# EAGLE design Mimi_layout (EAGLE 7.6.0)
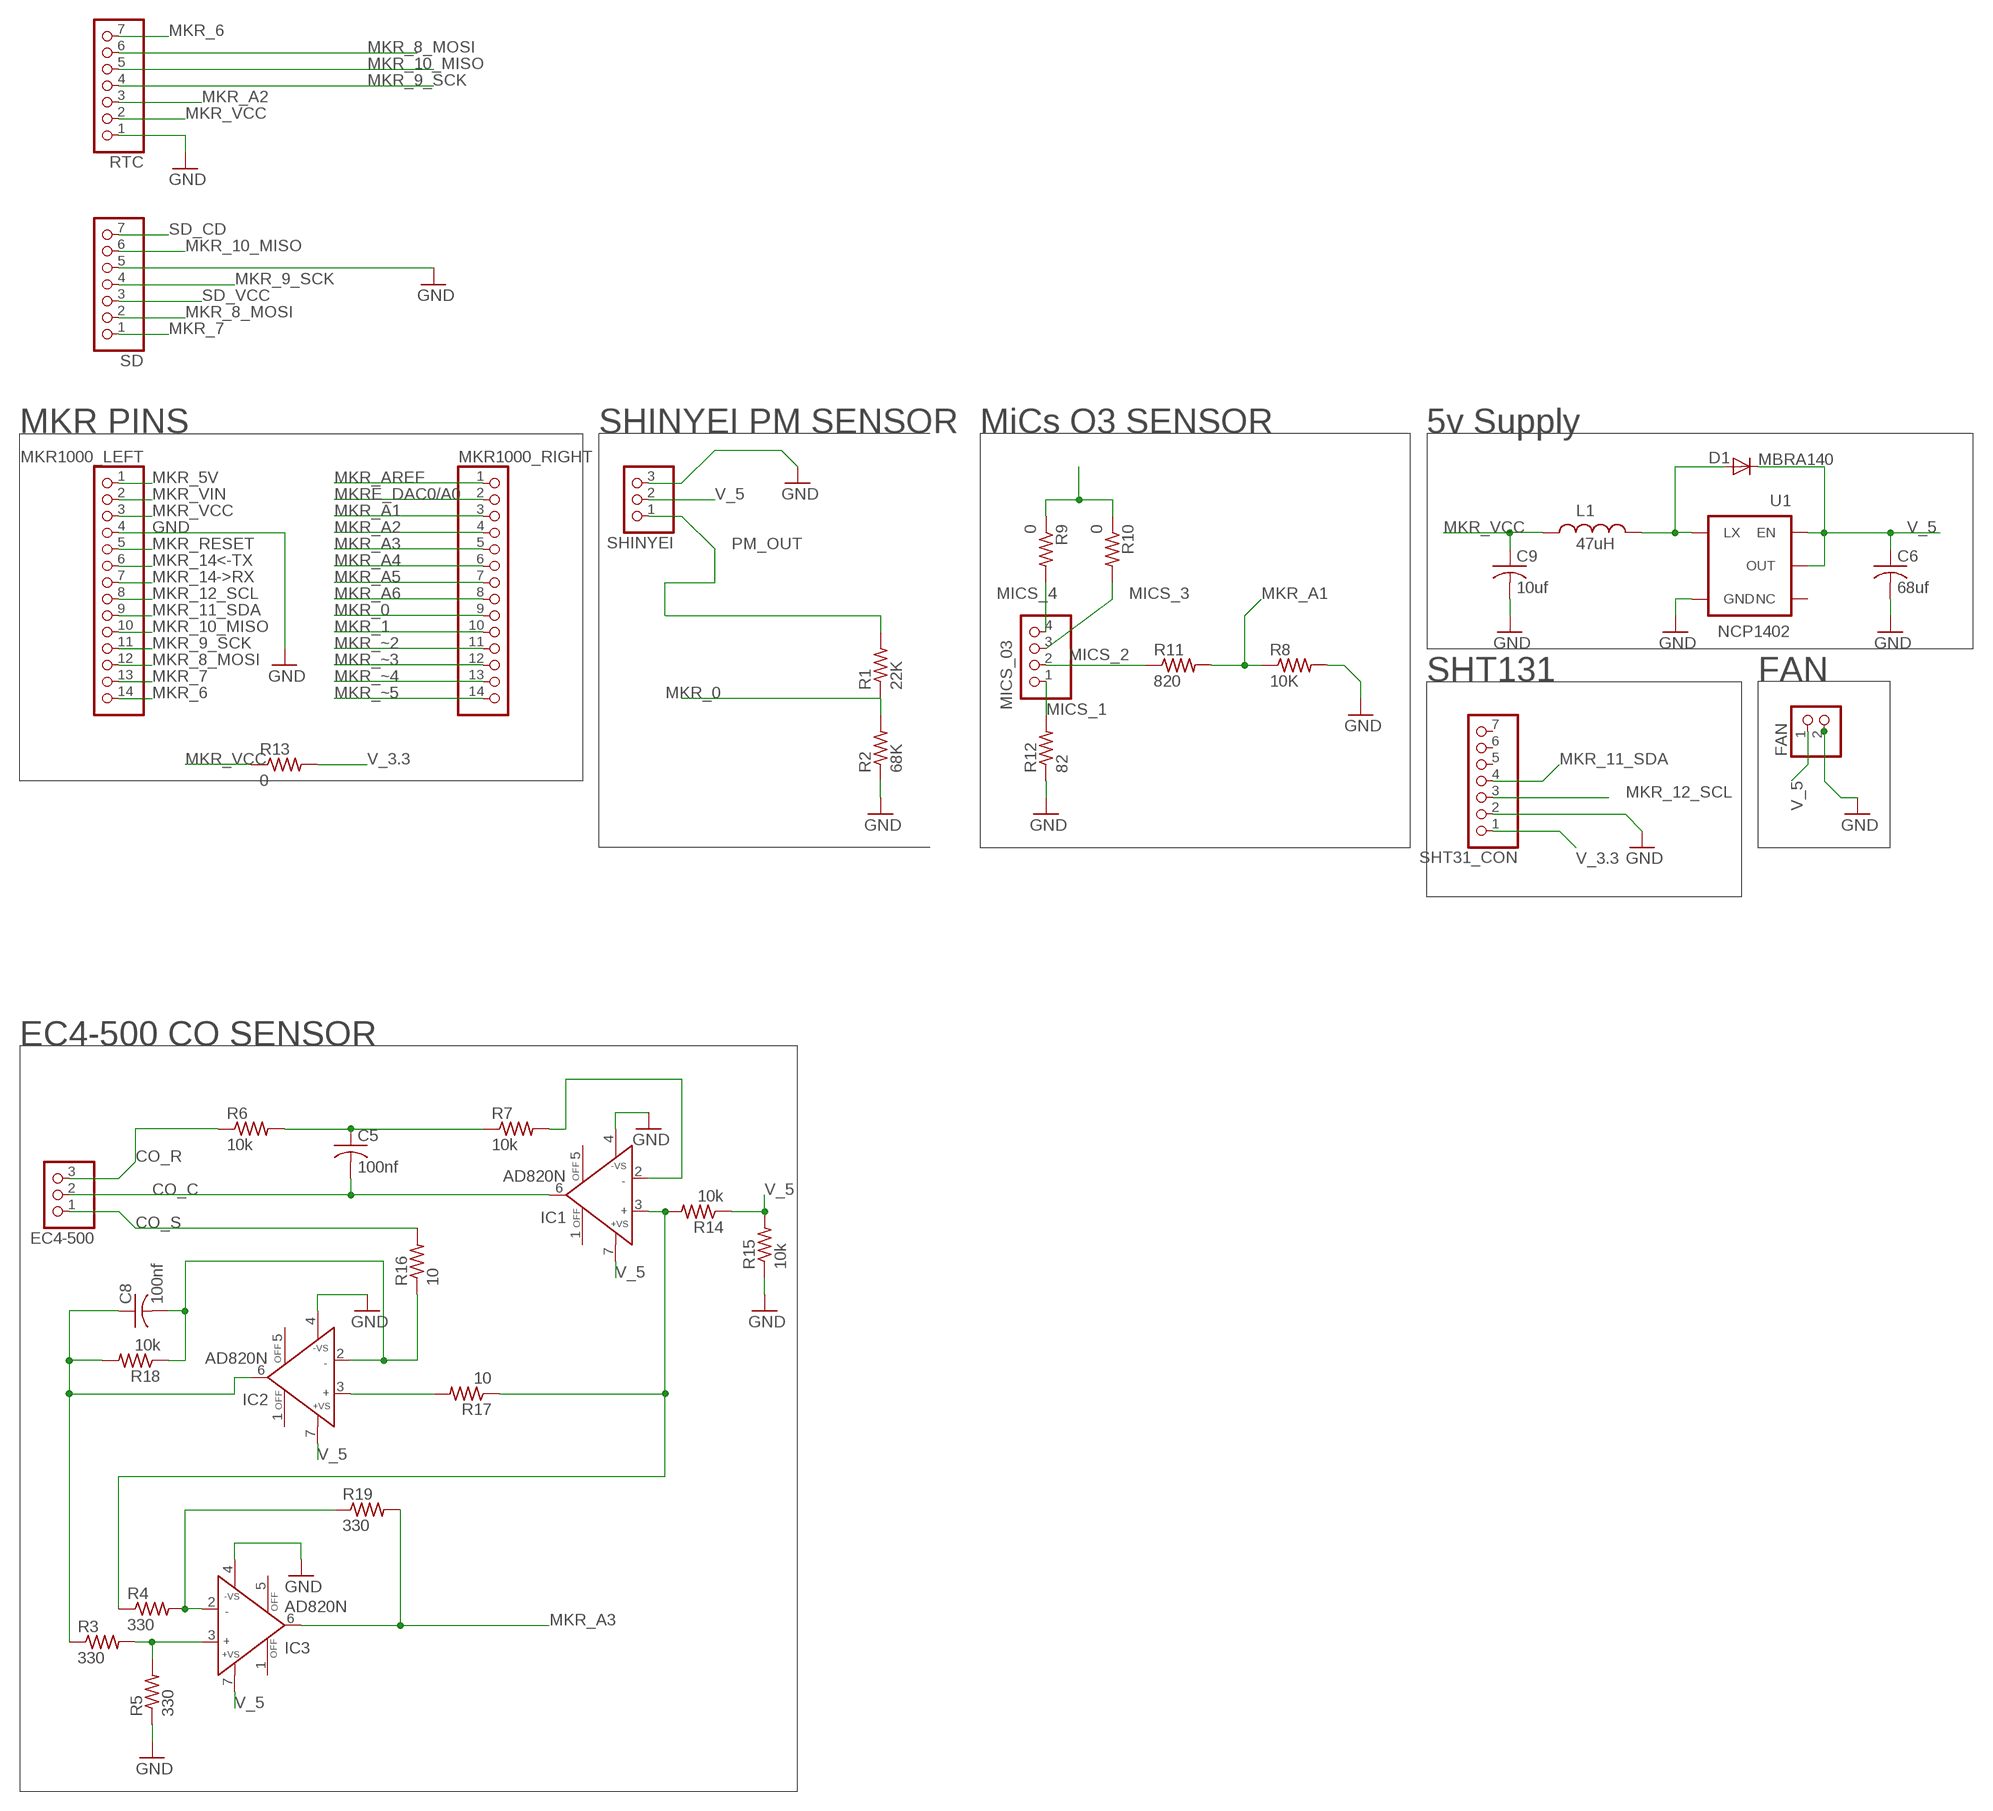
[diagram p0: schematic, sheet 1]

## Parts
C5  100nf  C-USC0805  [C0805]
C6  68uf  C-USC0805  [C0805]
C8  100nf  C-USC0805  [C0805]
C9  10uf  C-USC0805  [C0805]
D1  MBRA140  DIODESMA  [SMA-DIODE]
EC4-500  PINHD-1X3  [1X03]
FAN  PINHD-1X2  [1X02]
IC1  AD820N  [DIL08]
IC2  AD820N  [DIL08]
IC3  AD820N  [DIL08]
L1  47uH  INDUCTORCR54  [CR54]
MICS_03  PINHD-1X4  [1X04]
MKR1000_LEFT  PINHD-1X14  [1X14]
MKR1000_RIGHT  PINHD-1X14  [1X14]
R1  22K  R-US_R0805  [R0805]
R2  68K  R-US_R0805  [R0805]
R3  330  R-US_R0805  [R0805]
R4  330  R-US_R0805  [R0805]
R5  330  R-US_R0805  [R0805]
R6  10k  R-US_R0805  [R0805]
R7  10k  R-US_R0805  [R0805]
R8  10K  R-US_R0805  [R0805]
R9  0  R-US_R0805  [R0805]
R10  0  R-US_R0805  [R0805]
R11  820  R-US_R0805  [R0805]
R12  82  R-US_R0805  [R0805]
R13  0  R-US_R0805  [R0805]
R14  10k  R-US_R0805  [R0805]
R15  10k  R-US_R0805  [R0805]
R16  10  R-US_R0805  [R0805]
R17  10  R-US_R0805  [R0805]
R18  10k  R-US_R0805  [R0805]
R19  330  R-US_R0805  [R0805]
RTC  PINHD-1X7  [1X07]
SD  PINHD-1X7  [1X07]
SHINYEI  PINHD-1X3  [1X03]
SHT31_CON  PINHD-1X7  [1X07]
U1  NCP1402  V_REG_NCP1400SOT23-5  [SOT23-5]

## Nets
CO_C: C5.2 EC4-500.2 IC1.6(OUT)
CO_R: EC4-500.3 R6.1
CO_S: EC4-500.1 R16.2
GND: C6.2 C9.2 FAN.2 IC1.4(-VS) IC2.4(-VS) IC3.4(-VS) MKR1000_LEFT.4 R2.1 R5.1 R8.2 R12.1 R15.1 RTC.1 SD.5 SHINYEI.3 SHT31_CON.2 U1.4(GND)
MICS_1: MICS_03.1 R12.2
MICS_2: MICS_03.2 R11.1
MICS_3: MICS_03.3 R10.2
MICS_4: MICS_03.4 R9.2
MKR_0: MKR1000_RIGHT.9 R1.1 R2.2
MKR_1: MKR1000_RIGHT.10
MKR_5V: MKR1000_LEFT.1
MKR_6: MKR1000_LEFT.14 RTC.7
MKR_7: MKR1000_LEFT.13 SD.1
MKR_8_MOSI: MKR1000_LEFT.12 RTC.6 SD.2
MKR_9_SCK: MKR1000_LEFT.11 RTC.4 SD.4
MKR_10_MISO: MKR1000_LEFT.10 RTC.5 SD.6
MKR_11_SDA: MKR1000_LEFT.9 SHT31_CON.4
MKR_12_SCL: MKR1000_LEFT.8 SHT31_CON.3
MKR_14->RX: MKR1000_LEFT.7
MKR_14<-TX: MKR1000_LEFT.6
MKR_A1: MKR1000_RIGHT.3 R8.1 R11.2
MKR_A2: MKR1000_RIGHT.4 RTC.3
MKR_A3: IC3.6(OUT) MKR1000_RIGHT.5 R19.2
MKR_A4: MKR1000_RIGHT.6
MKR_A5: MKR1000_RIGHT.7
MKR_A6: MKR1000_RIGHT.8
MKR_AREF: MKR1000_RIGHT.1
MKR_RESET: MKR1000_LEFT.5
MKR_VCC: C9.1 L1.P$1 MKR1000_LEFT.3 R13.1 RTC.2
MKR_VIN: MKR1000_LEFT.2
MKR_~2: MKR1000_RIGHT.11
MKR_~3: MKR1000_RIGHT.12
MKR_~4: MKR1000_RIGHT.13
MKR_~5: MKR1000_RIGHT.14
MKRE_DAC0/A0: MKR1000_RIGHT.2
N$3: D1.A L1.P$2 U1.5(LX)
N$4: C5.1 R6.2 R7.1
N$5: IC1.3(IN+) R4.1 R14.2 R17.1
N$6: IC1.2(IN-) R7.2
N$7: IC2.3(IN+) R17.2
N$8: C8.2 IC2.2(IN-) R16.1 R18.1
N$9: C8.1 IC2.6(OUT) R3.1 R18.2
N$10: IC3.3(IN+) R3.2 R5.2
N$11: IC3.2(IN-) R4.2 R19.1
PM_OUT: R1.2 SHINYEI.1
SD_CD: SD.7
SD_VCC: SD.3
V_3.3: R13.2 SHT31_CON.1
V_5: C6.1 D1.C FAN.1 IC1.7(+VS) IC2.7(+VS) IC3.7(+VS) R9.1 R10.1 R14.1 R15.2 SHINYEI.2 U1.1(EN) U1.2(OUT)
Unconnected: IC1.1(OFF) IC1.5(OFF) IC2.1(OFF) IC2.5(OFF) IC3.1(OFF) IC3.5(OFF) SHT31_CON.5 SHT31_CON.6 SHT31_CON.7 U1.3(NC)

## Notes on the sheet
- MKR PINS | SHINYEI PM SENSOR | MiCs O3 SENSOR | 5v Supply
- SHT131 | FAN
- EC4-500 CO SENSOR

## Library data of the parts
C5 C6 C8 C9 = resistor:C-US: CAPACITOR, American symbol
D1 = SparkFun:DIODE: Diode These are standard reverse protection diodes and small signal diodes. SMA package can handle up to about 1A. SOD-323 can handle about 200mA. What the SOD-323 package when ordering, there are some mfgs out there that are 5-pin packages.
EC4-500 SHINYEI = pinhead:PINHD-1X3: PIN HEADER
FAN = pinhead:PINHD-1X2: PIN HEADER
IC1-IC3 = analog-devices:AD820N: Single-Supply, Rail-to-Rail, Low Power, FET Input Op Amp Source: http://www.analog.com/static/imported-files/data_sheets/AD820.pdf; OC_FARNELL: 1438579; OC_NEWARK: unknown
L1 = SparkFun:INDUCTOR: Inductors Basic Inductor/Choke - 0603 and 1206. Footprints are not proven and vary greatly between part numbers.
MICS_03 = pinhead:PINHD-1X4: PIN HEADER
MKR1000_LEFT MKR1000_RIGHT = pinhead:PINHD-1X14: PIN HEADER
R1-R19 = resistor:R-US_: RESISTOR, American symbol
RTC SD SHT31_CON = pinhead:PINHD-1X7: PIN HEADER
U1 = SparkFun:V_REG_NCP1400: Switching step-up voltage regulator NCP1400 switiching regulator takes single cell AA and outputs 100mA at 3.3V or 5V with minimal number of external components.

## Board
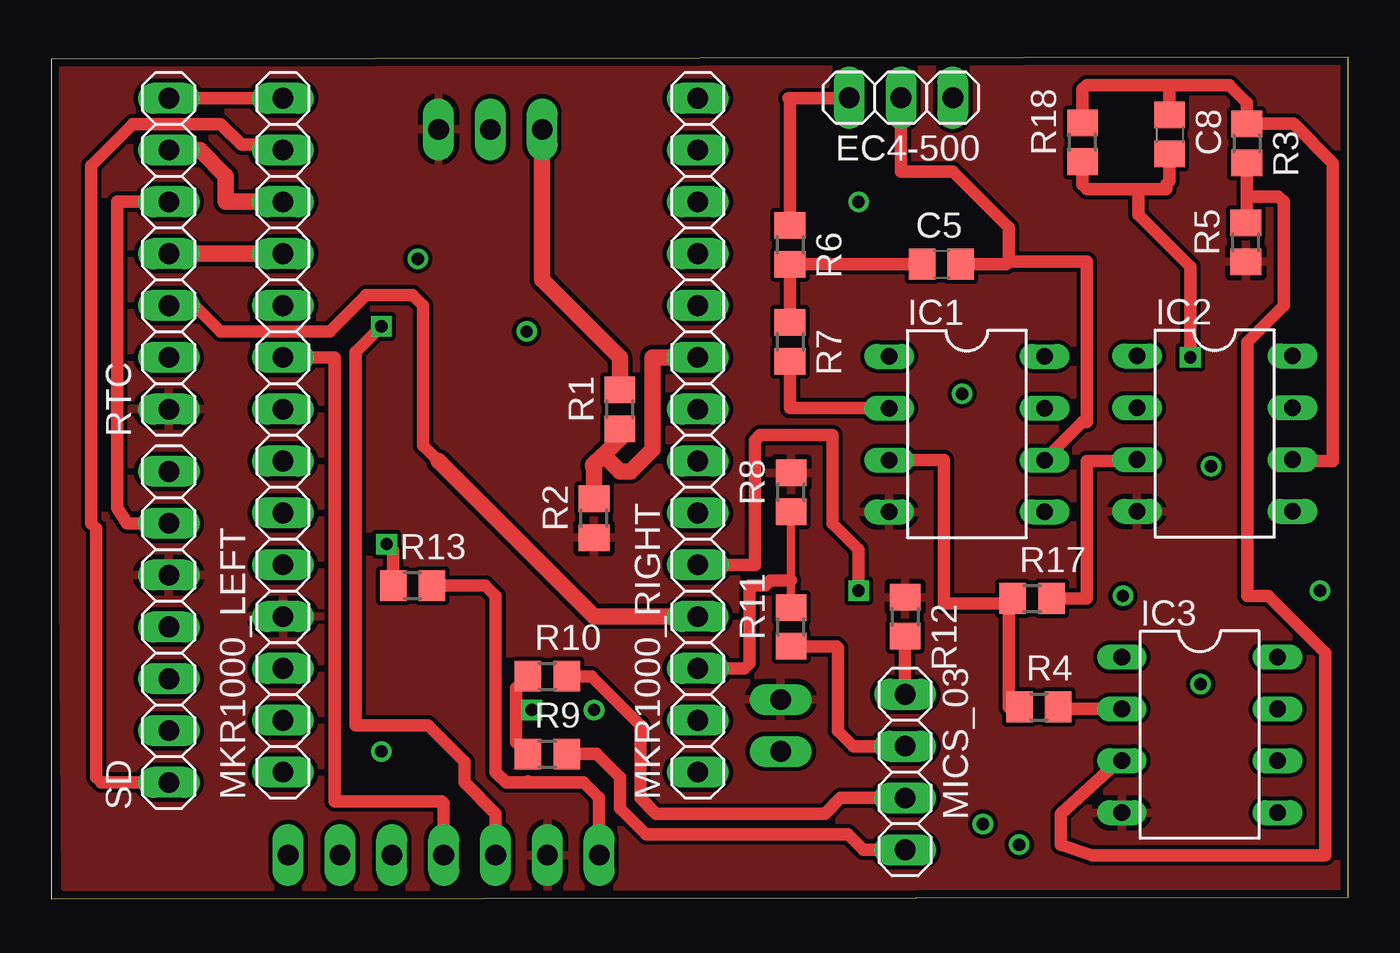
[diagram p1: board, top side]
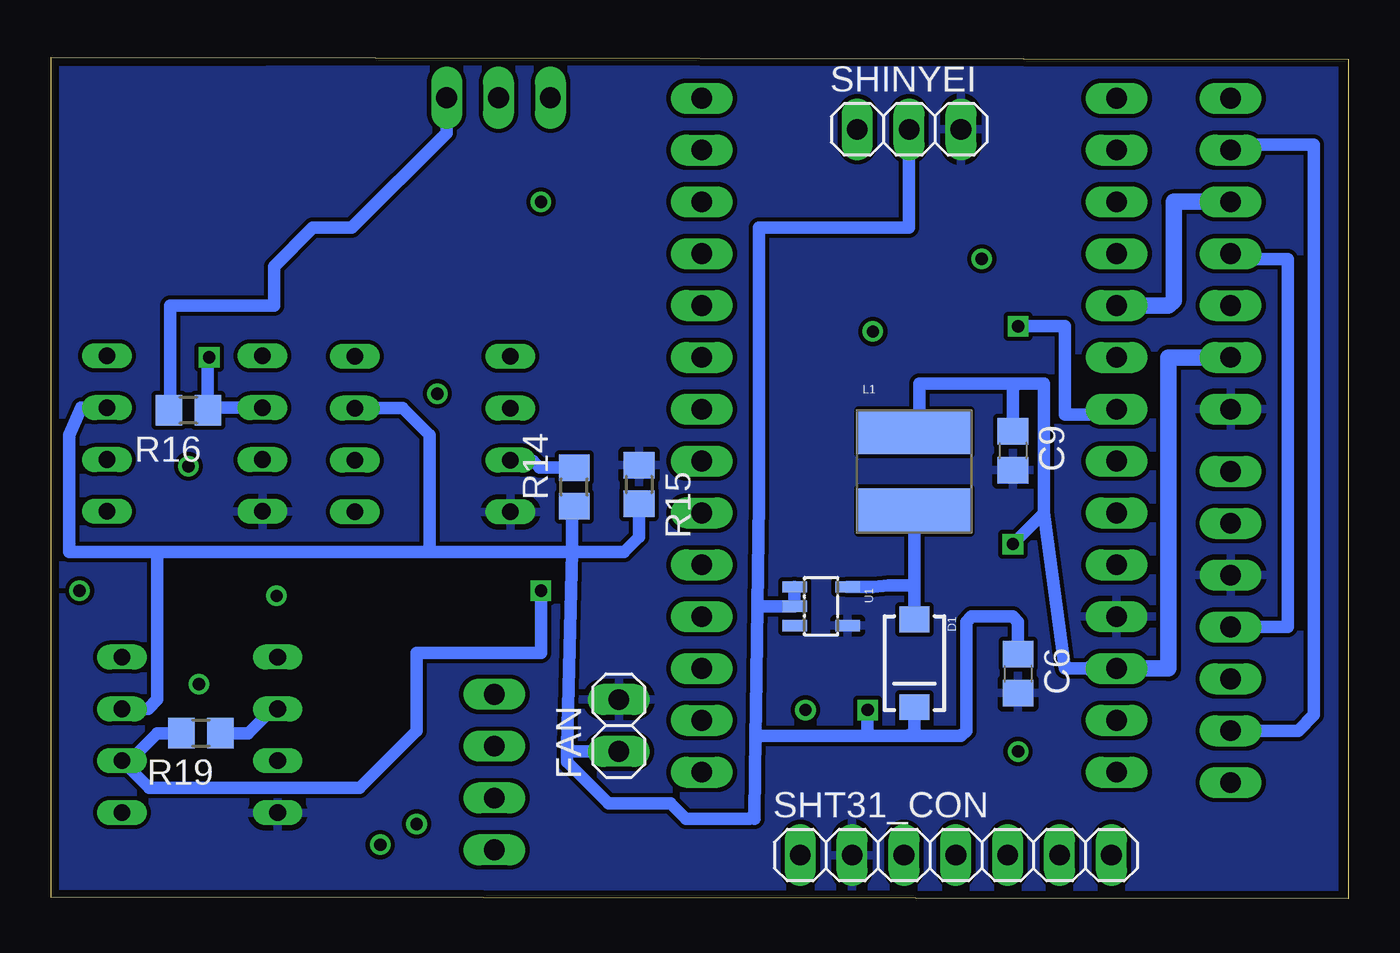
[diagram p2: board, bottom side, seen from below]

Size 63.56 x 41.23 mm. Coordinates in mm from the lower left corner, seen from the top.
Outline: 0,0 63.56,0.09 63.56,41.23 0,41.14 0,0
Copper layers (1*16): Top 0.0178mm / dielectric 59mil / Bottom 0.0178mm
Design rules "epl-lpkf": minimum track width 8mil, minimum drill 0.35mm, track to track 8mil, track to pad 8mil, pad to pad 8mil, via to via 8mil, smd to smd 8mil, copper to edge 15mil, drill to drill 15mil, minimum pad ring 8mil, minimum via ring 8mil, stop-mask expansion 3mil, vias tented up to drill 0mil, thermal gap 10mil

### Footprints (pad centres in the part's own frame; a part is rotated, then mirrored left to right if it is on the bottom)
C0805 = smd 1.3 x 1.5: 1 -0.95,0; 2 0.95,0
SMA-DIODE = smd 1.27 x 1.47: A -2.15,0; C 2.15,0
1X03 = drill 1.016 long: 1 -2.54,0; 2 0,0; 3 2.54,0
1X02 = drill 1.016 long: 1 -1.27,0; 2 1.27,0
DIL08 = drill 0.813 long: 1 -3.81,-3.81; 2 -1.27,-3.81; 3 1.27,-3.81; 4 3.81,-3.81; 5 3.81,3.81; 6 1.27,3.81; 7 -1.27,3.81; 8 -3.81,3.81
CR54 = smd 5.5 x 2.15: P$1 0,1.92; P$2 0,-1.92
1X04 = drill 1.016 long: 1 -3.81,0; 2 -1.27,0; 3 1.27,0; 4 3.81,0
1X14 = drill 1.016 long: 1 -16.51,0; 2 -13.97,0; 3 -11.43,0; 4 -8.89,0; 5 -6.35,0; 6 -3.81,0; 7 -1.27,0; 8 1.27,0; 9 3.81,0; 10 6.35,0; 11 8.89,0; 12 11.43,0; 13 13.97,0; 14 16.51,0
R0805 = smd 1.3 x 1.5: 1 -0.95,0; 2 0.95,0
1X07 = drill 1.016 long: 1 -7.62,0; 2 -5.08,0; 3 -2.54,0; 4 0,0; 5 2.54,0; 6 5.08,0; 7 7.62,0
SOT23-5 = smd 0.55 x 1.2: 1 -0.95,-1.3; 2 0,-1.3; 3 0.95,-1.3; 4 0.95,1.3; 5 -0.95,1.3

### Placement (x,y rotation side)
C5  43.62,31.1 0 top
C6  16.19,11.04 270 bottom
C8  54.79,37.45 270 top
C9  16.44,21.96 270 bottom
D1  21.27,11.55 270 bottom
EC4-500  41.64,39.26 180 top
FAN  35.74,8.5 90 bottom
IC1  44.86,22.77 270 top
IC2  57,22.8 270 top
IC3  56.27,8.04 270 top
L1  21.27,20.94 0 bottom
MICS_03  41.84,6.21 270 top
MKR1000_LEFT  11.36,22.72 90 top
MKR1000_RIGHT  31.68,22.72 90 top
R1  27.87,23.99 90 top
R2  26.6,18.66 90 top
R3  58.58,37.02 270 top
R4  48.39,9.41 0 top
R5  58.53,32.17 90 top
R6  36.2,32.04 270 top
R7  36.2,27.29 270 top
R8  36.25,19.93 90 top
R9  24.31,7.1 0 top
R10  24.31,10.91 0 top
R11  36.25,13.32 90 top
R12  41.84,13.83 270 top
R13  17.71,15.36 0 top
R14  37.93,20.18 90 bottom
R15  34.75,20.31 270 bottom
R16  56.83,23.94 180 bottom
R17  48.06,14.72 0 top
R18  50.53,37.07 90 top
R19  56.22,8.12 180 bottom
RTC  5.77,31.61 90 top
SD  5.77,13.32 90 top
SHINYEI  21.52,37.71 0 bottom
SHT31_CON  19.23,2.15 0 bottom
U1  25.84,14.34 270 bottom

### Tracks (layer width: path | path; a pad name or v marks a point on that pad's centre or on a via)
CO_C
  Top 0.61: 46.92,31.23 50.73,31.23 50.73,23.36 50.53,23.36 IC1.6 | EC4-500.2 41.64,35.62 44.18,35.62 46.92,32.88 46.92,31.23 | C5.2 46.79,31.1 46.92,31.23
CO_R
  Top 0.61: R6.1 36.2,39.16 36.12,39.23 39.07,39.23 EC4-500.3
CO_S
  Bottom 0.61: EC4-500.1 44.18,37.53 48.83,32.88 50.73,32.88 52.63,30.98 52.63,29.07 57.71,29.07 57.71,24 R16.2
GND
  pour Bottom: 0.69,40.76 63.51,40.6 63.51,0.22 0.69,0.37
  pour Top: 0.44,40.94 63.51,40.71 63.76,0.32 0.69,0.55
MICS_1
  Top 0.61: R12.2 MICS_03.1
MICS_2
  Top 0.61: 41.84,7.8 MICS_03.2 39.3,7.48 38.54,8.24 38.54,12.31 38.47,12.37 R11.1
MICS_3
  Top 0.61: MICS_03.3 38.66,4.94 37.9,4.18 29.65,4.18 28.89,4.94 28.89,8.5 26.47,10.91 R10.2
MICS_4
  Top 0.61: MICS_03.4 39.81,2.4 39.05,3.16 29.14,3.16 27.87,4.43 27.87,5.96 26.73,7.1 R9.2
MKR_0
  Top 0.813: MKR1000_RIGHT.9 29.46,26.53 29.46,22.03 28.38,20.94 27.87,20.94 27.06,21.76 | R2.2 26.6,21.05 26.55,21.25 27.06,21.76 | R1.1 27.87,22.57 27.06,21.76
MKR_6
  Top 0.61: RTC.7 MKR1000_LEFT.14
MKR_7
  Top 0.61: SD.1 2.47,5.7 2.22,5.96 2.22,18.15 1.96,18.4 1.96,35.93 3.99,37.96 8.31,37.96 9.33,36.95 11.11,36.95 MKR1000_LEFT.13
MKR_8_MOSI
  Top 0.813: RTC.6 7.3,36.69 8.57,35.42 8.57,34.15 MKR1000_LEFT.12
  Bottom 0.61: SD.2 2.47,8.24 1.71,9.01 1.71,36.95 5.52,36.95 RTC.6
MKR_9_SCK
  Top 0.813: RTC.4 MKR1000_LEFT.11
  Bottom 0.61: SD.4 2.98,13.32 2.98,31.36 5.52,31.36 RTC.4
MKR_10_MISO
  Top 0.61: SD.6 3.74,18.4 3.23,19.17 3.23,34.15 RTC.5
  Bottom 0.813: RTC.5 8.57,34.15 8.57,29.33 8.82,29.07 MKR1000_LEFT.10
MKR_11_SDA
  Top 0.61: MKR1000_LEFT.9 13.9,26.53 13.9,4.79 19.13,4.79 19.23,4.69 SHT31_CON.4
MKR_12_SCL  (via drill 0.6)
  Top 0.61: v16.19,28.06 14.92,26.79 14.92,8.5 18.47,8.5 20.25,6.72 20.25,5.7 21.77,4.18 SHT31_CON.3
  Bottom 0.61: MKR1000_LEFT.8 11.61,23.74 13.9,23.74 13.9,28.06 v16.19,28.06
MKR_A1
  Top 0.406: R11.2 36.25,15.61 R8.1
  Top 0.61: MKR1000_RIGHT.3 33.97,11.29 34.22,11.55 34.22,15.36 34.98,15.36 35.24,15.61 36.25,15.61
MKR_A2
  Top 0.61: 18.98,21.45 18.22,22.21 18.22,29.07 17.71,29.58 15.42,29.58 13.65,27.8 8.31,27.8 7.04,29.07 RTC.3
  Top 0.813: MKR1000_RIGHT.4 26.6,13.83 18.98,21.45
MKR_A3  (via drill 0.6)
  Top 0.61: v39.55,15.1 39.55,17.13 38.28,18.4 38.28,22.72 34.73,22.72 34.47,22.47 34.47,16.37 MKR1000_RIGHT.5
  Bottom 0.61: R19.2 58.35,8.12 59.7,6.77 IC3.6 58.76,5.45 48.44,5.45 45.65,8.24 45.65,12.05 39.55,12.05 v39.55,15.1
MKR_VCC  (via drill 0.6)
  Top 0.61: R13.1 16.76,17.07 v16.44,17.39
  Bottom 0.61: 16.19,25.26 14.92,25.26 14.92,18.91 | 16.19,25.26 21.01,25.26 21.01,23.12 L1.P$1 | 12.63,11.29 13.9,11.29 14.92,18.91 | v16.44,17.39 14.92,18.91 | C9.1 16.44,25.01 16.19,25.26
  Bottom 0.813: 12.63,11.29 MKR1000_LEFT.3 8.82,11.29 8.82,26.53 RTC.2
N$1  (via drill 0.6)
  other vias: 39.55,34.15
N$2  (via drill 0.6)
  other vias: 17.96,31.36
N$3
  Bottom 0.61: L1.P$2 21.27,15.36 | 21.27,15.36 D1.A | U1.5 23.3,15.29 22.54,15.36 21.27,15.36
N$4
  Top 0.61: R7.1 R6.2 C5.1
N$5
  Top 0.61: IC1.3 43.74,21.5 43.74,14.47 46.92,14.47 | R17.1 47.11,14.47 46.92,14.47 | 46.92,14.47 46.92,9.39 47.44,9.39 R4.1
  Bottom 0.61: R14.2 39.62,21.13 39.94,21.45 41,21.45 IC1.3
N$6
  Top 0.61: IC1.2 36.2,24.04 R7.2
N$7
  Top 0.61: R17.2 50.73,14.72 50.73,21.45 53.19,21.45 IC2.3
N$8  (via drill 0.6)
  Top 0.61: R18.1 50.53,34.99 50.73,34.79 53.27,34.79 | 53.27,34.79 54.65,34.79 54.65,35.02 54.79,35.17 C8.2 | v55.81,26.53 55.81,30.98 53.27,33.52 53.27,34.79
  Bottom 0.61: IC2.2 55.88,24.07 | 55.88,24.07 R16.1 | 55.88,24.07 55.88,26.47 v55.81,26.53
N$9
  Top 0.61: R18.2 50.53,39.66 50.73,39.87 54.79,39.87 | 54.79,39.87 57.71,39.87 58.58,39 R3.1 60.88,37.97 62.8,36.06 62.8,21.45 60.89,21.45 IC2.6 | C8.1 54.79,39.87
N$10
  Top 0.61: R3.2 58.58,34.41 | 58.58,34.41 58.58,33.17 R5.2 | IC3.3 52.3,6.77 49.46,4.18 49.46,2.66 50.98,2.15 62.41,2.15 62.41,12.05 59.62,14.85 58.6,14.85 58.6,27.29 60.38,29.07 60.38,34.15 60.13,34.41 58.58,34.41
N$11
  Top 0.61: IC3.2 49.45,9.31 R4.2
  Bottom 0.61: IC3.2 52.71,9.31 53.91,8.12 R19.1
N$12  (via drill 0.6)
  other vias: 26.6,9.26
N$13  (via drill 0.6)
  other vias: 45.65,3.67
N$14  (via drill 0.6)
  other vias: 52.51,14.85
N$15  (via drill 0.6)
  other vias: 62.16,15.1
N$16  (via drill 0.6)
  other vias: 23.3,27.8
N$17  (via drill 0.6)
  other vias: 16.19,7.23
N$18  (via drill 0.6)
  other vias: 47.43,2.66
N$19  (via drill 0.6)
  other vias: 56.32,10.53
N$20  (via drill 0.6)
  other vias: 56.83,21.2
N$21  (via drill 0.6)
  other vias: 44.63,24.75
PM_OUT
  Top 0.813: SHINYEI.1 24.06,30.34 27.87,26.53 R1.2
V_3.3
  Top 0.61: 23.36,5.77 23.3,5.7 | 23.3,5.7 26.09,5.7 26.85,4.94 SHT31_CON.1 | R13.2 21.27,15.36 21.77,14.85 21.77,6.21 22.28,5.7 23.3,5.7
V_5  (via drill 0.6)
  Top 0.406: R10.1 22.79,10.34 | R9.1 22.79,7.67
  Top 0.61: 22.79,10.34 22.79,9.26 | 22.79,9.26 v23.55,9.26 | 22.79,7.67 22.79,9.26
  Bottom 0.61: 28.96,14.35 28.89,19.42 28.89,32.88 21.52,32.88 SHINYEI.2 | 28.96,14.35 29.03,9.26 | 29.03,9.26 29.04,8 | 29.04,8 29.1,4.17 | 29.1,4.17 29.1,3.93 | 38.27,7.5 38.28,6.97 38.28,6.72 36.25,4.69 33.2,4.69 32.44,3.93 29.34,3.93 29.1,4.17 | 38.27,7.5 38.03,17.01 | 38.03,17.01 38.03,19.13 R14.1 | R15.2 34.75,17.74 35.49,17.01 38.03,17.01 | IC1.7 46.34,24.04 45.02,22.72 45.02,17.01 | 45.02,17.01 38.03,17.01 | IC2.7 62.08,24.07 62.67,22.72 62.67,17.01 58.35,17.01 | 58.35,17.01 45.02,17.01 | IC3.7 58.81,9.31 58.35,9.77 58.35,17.01 | U1.1 U1.2 28.95,14.34 28.96,14.35 | 29.03,9.51 29.03,9.26 | FAN.1 38,7.23 38.27,7.5 | 21.52,7.99 18.98,7.99 18.73,8.24 18.73,13.58 18.47,13.83 16.44,13.83 16.19,13.58 C6.1 | 21.52,7.99 23.55,7.99 | 23.55,7.99 29.04,7.99 29.04,8 | D1.C 21.27,8.24 21.52,7.99 | v23.55,9.26 23.55,7.99